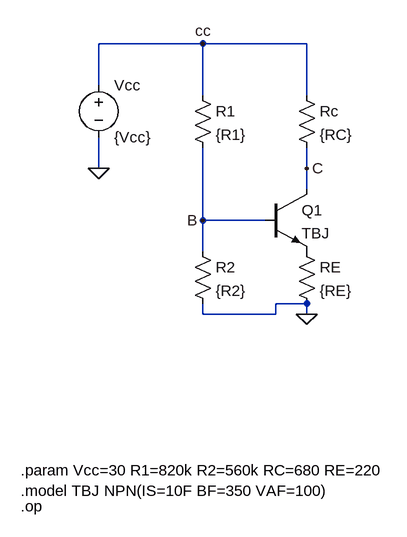
[diagram p0: schematic TBJ05CAop.asc]
TBJ05CAop.asc, the LTspice schematic file:
Version 4
SHEET 1 1608 1076
WIRE 128 -16 -32 -16
WIRE 288 -16 128 -16
WIRE -32 48 -32 -16
WIRE 128 64 128 -16
WIRE 288 64 288 -16
WIRE -32 176 -32 128
WIRE 288 176 288 144
WIRE 288 208 288 176
WIRE 128 256 128 144
WIRE 224 256 128 256
WIRE 128 304 128 256
WIRE 288 384 240 384
WIRE 128 400 128 384
WIRE 240 400 240 384
WIRE 240 400 128 400
WIRE 288 400 288 384
FLAG -32 176 0
FLAG 288 400 0
FLAG 128 -16 cc
FLAG 128 256 B
FLAG 288 176 C
SYMBOL res 112 48 R0
SYMATTR InstName R1
SYMATTR Value {R1}
SYMBOL res 272 48 R0
SYMATTR InstName Rc
SYMATTR Value {RC}
SYMBOL voltage -32 32 R0
WINDOW 123 0 0 Left 0
WINDOW 39 0 0 Left 0
SYMATTR InstName Vcc
SYMATTR Value {Vcc}
SYMBOL npn 224 208 R0
SYMATTR InstName Q1
SYMATTR Value TBJ
SYMBOL res 272 288 R0
SYMATTR InstName RE
SYMATTR Value {RE}
SYMBOL res 112 288 R0
SYMATTR InstName R2
SYMATTR Value {R2}
TEXT -152 640 Left 2 !.param Vcc=30 R1=820k R2=560k RC=680 RE=220
TEXT -152 696 Left 2 !.op
TEXT -152 672 Left 2 !.model TBJ NPN(IS=10F BF=350 VAF=100)

The netlist it stands for:
* TBJ05CAop.asc
R1 cc B {R1}
Rc cc C {RC}
Vcc cc 0 {Vcc}
Q1 C B P001 0 TBJ
RE P001 0 {RE}
R2 B 0 {R2}
.model NPN NPN
.model PNP PNP
.lib standard.bjt
.param Vcc=30 R1=820k R2=560k RC=680 RE=220
.op
.model TBJ NPN(IS=10F BF=350 VAF=100)
.backanno
.end